# EAGLE design RF (EAGLE 9.6.1)
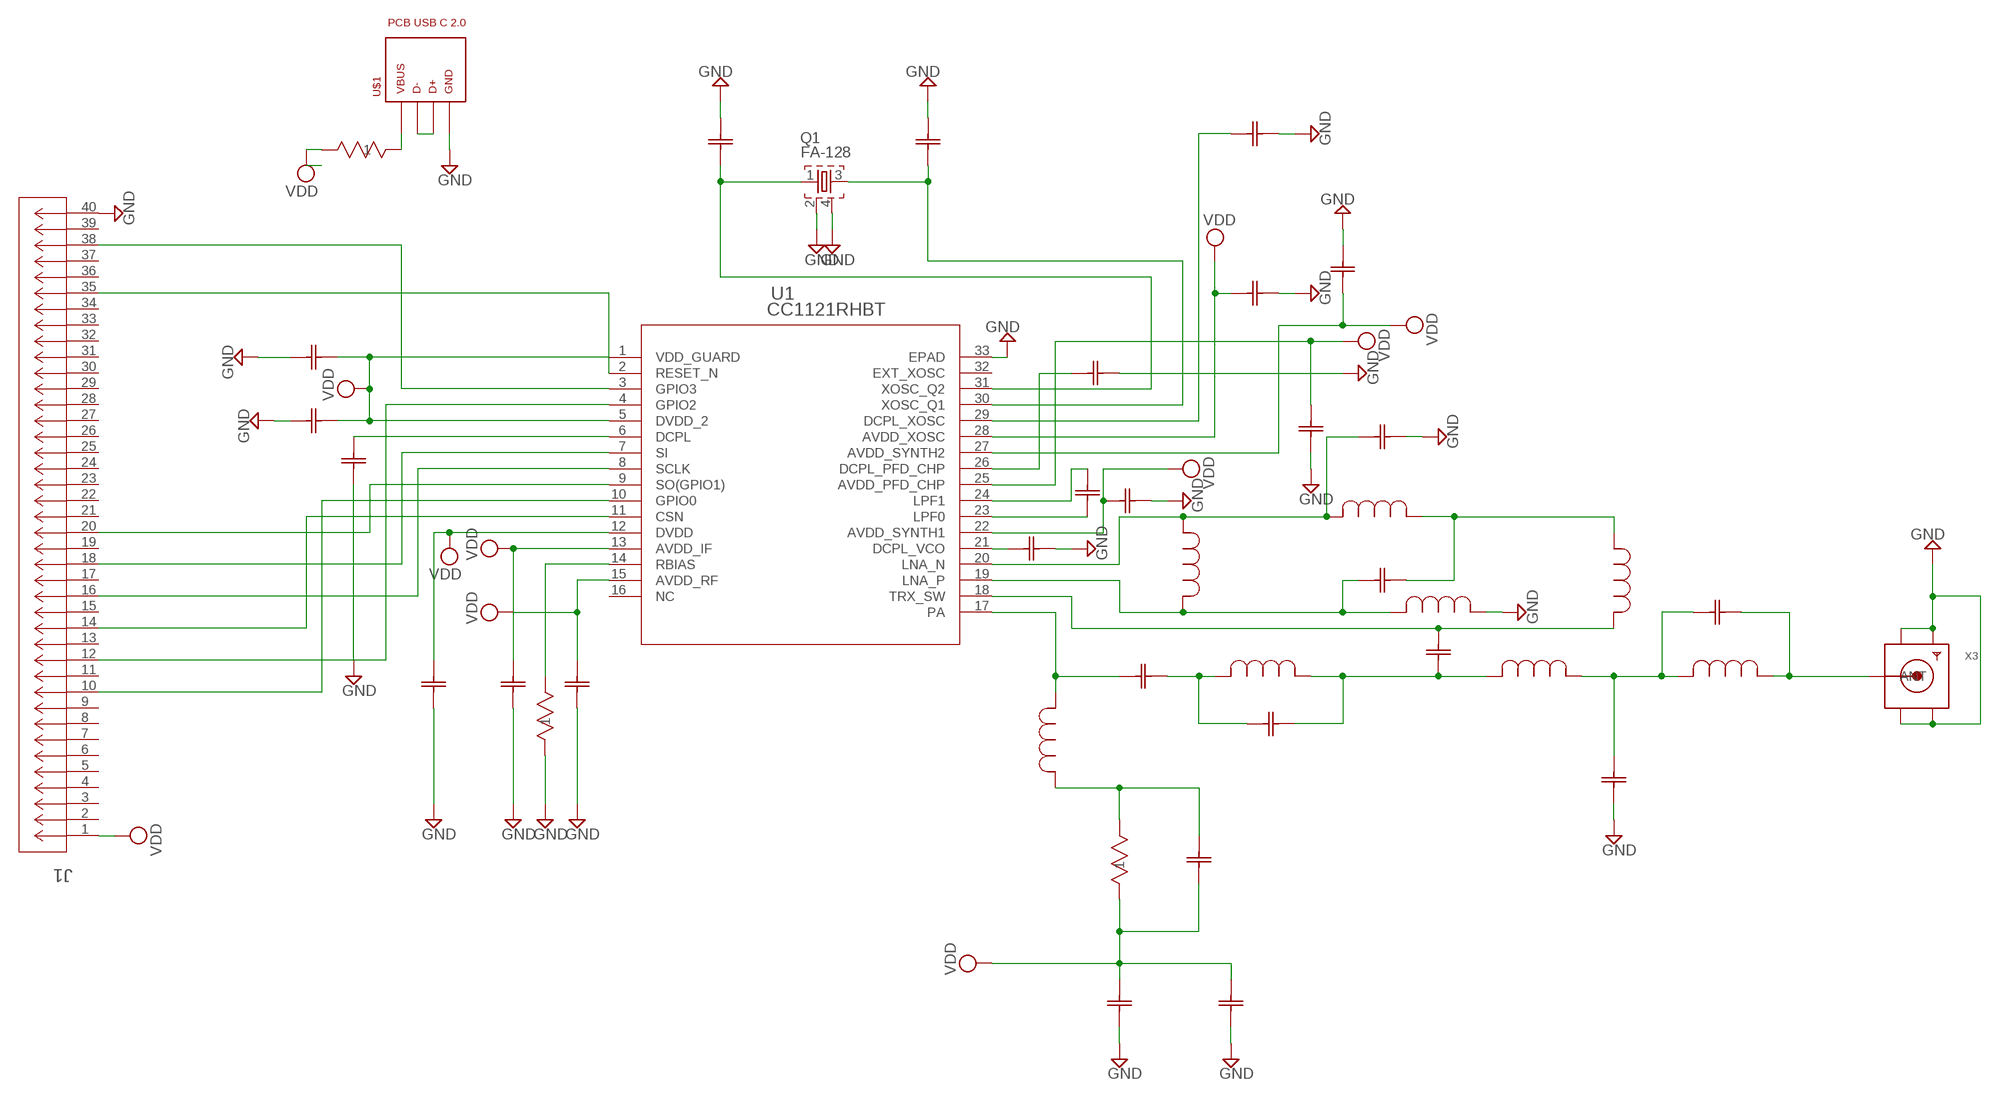
[diagram p0: schematic, sheet 1]

## Parts
C1  220nF  GRM155R71A104KA01D  [G-155_MUR]
C2  47nF  GRM155R71A104KA01D  [G-155_MUR]
C3  15pF  GRM155R71A104KA01D  [G-155_MUR]
C4  1pF  GRM155R71A104KA01D  [G-155_MUR]
C5  2.2pF  GRM155R71A104KA01D  [G-155_MUR]
C6  47nF  GRM155R71A104KA01D  [G-155_MUR]
C7  47nF  GRM155R71A104KA01D  [G-155_MUR]
C8  47nF  GRM155R71A104KA01D  [G-155_MUR]
C9  220nF  GRM155R71A104KA01D  [G-155_MUR]
C10  33pF  GRM155R71A104KA01D  [G-155_MUR]
C11  10pF  GRM155R71A104KA01D  [G-155_MUR]
C12  10pF  GRM155R71A104KA01D  [G-155_MUR]
C13  3pF  GRM155R71A104KA01D  [G-155_MUR]
C14  GRM155R71A104KA01D  [G-155_MUR]
C15  3.3pF  GRM155R71A104KA01D  [G-155_MUR]
C16  3.3pF  GRM155R71A104KA01D  [G-155_MUR]
C17  10nF  GRM155R71A104KA01D  [G-155_MUR]
C18  10nF  GRM155R71A104KA01D  [G-155_MUR]
C19  1.8nF  GRM155R71A104KA01D  [G-155_MUR]
C20  47nF  GRM155R71A104KA01D  [G-155_MUR]
C21  47nF  GRM155R71A104KA01D  [G-155_MUR]
C22  47nF  GRM155R71A104KA01D  [G-155_MUR]
C23  47nF  GRM155R71A104KA01D  [G-155_MUR]
C24  15pF  GRM155R71A104KA01D  [G-155_MUR]
C25  15pF  GRM155R71A104KA01D  [G-155_MUR]
C26  47nF  GRM155R71A104KA01D  [G-155_MUR]
J1  CLT-110-02-L-D-BE  [CON20_2X10_DUME_CLT_SAI]
L1  10nH  LQW15AN13NG00D  [IND_LQW15AN13NG00D_MUR]
L2  10nH  LQW15AN13NG00D  [IND_LQW15AN13NG00D_MUR]
L3  10nH  LQW15AN13NG00D  [IND_LQW15AN13NG00D_MUR]
L4  12nH  LQW15AN13NG00D  [IND_LQW15AN13NG00D_MUR]
L5  15nH  LQW15AN13NG00D  [IND_LQW15AN13NG00D_MUR]
L6  12nH  LQW15AN13NG00D  [IND_LQW15AN13NG00D_MUR]
L7  12nH  LQW15AN13NG00D  [IND_LQW15AN13NG00D_MUR]
L8  12nH  LQW15AN13NG00D  [IND_LQW15AN13NG00D_MUR]
Q1  FA-128  [FA-128]
R1  56k  RK73H1ETTP1003F  [RES_1E0402_1XP5_KOA]
R2  56k  RK73H1ETTP1003F  [RES_1E0402_1XP5_KOA]
R3  56k  RK73H1ETTP1003F  [RES_1E0402_1XP5_KOA]
U1  CC1121RHBT  [RHB32_3P45X3P45_TEX]
U$1  PCB_USB_C_2.0DS_1  [USB_TYPE_C_DS_1]
X3  SMACONNECTOR_EDGE  [SMA_EDGELAUNCH]

## Nets
GND: C1.1 C2.1 C6.1 C7.1 C8.1 C9.1 C11.1 C12.1 C13.1 C16.2 C17.2 C18.2 C20.1 C21.2 C22.2 C23.2 C24.2 C25.2 C26.2 J1.40 L8.1 Q1.2 Q1.4 R1.1 U1.33(EPAD) U$1.A1(GND) U$1.A12(GND) U$1.B1(GND) U$1.B12(GND) X3.GND@1(GND4) X3.GND@2(GND3) X3.GND@3(GND2) X3.GND@4(GND1)
N$1: J1.35 U1.2(RESET_N)
N$2: J1.38 U1.3(GPIO3)
N$3: J1.12 U1.4(GPIO2)
N$4: C9.2 U1.6(DCPL)
N$5: J1.18 U1.7(SI)
N$6: J1.16 U1.8(SCLK)
N$7: J1.20 U1.9(SO(GPIO1))
N$8: J1.10 U1.10(GPIO0)
N$9: J1.14 U1.11(CSN)
N$10: R1.2 U1.14(RBIAS)
N$11: C3.1 L1.1 U1.17(PA)
N$12: C3.2 C4.1 L2.2
N$13: C5.2 L7.1 U1.18(TRX_SW)
N$14: C4.2 C5.1 L2.1 L3.2
N$15: C10.2 L1.2 R2.2
N$16: C15.2 L6.1 L7.2
N$17: C13.2 C14.1 L3.1 L4.2
N$18: C17.1 U1.21(DCPL_VCO)
N$19: C14.2 L4.1 X3.P(ANT)
N$20: C15.1 L5.1 L8.2 U1.19(LNA_P)
N$21: C16.1 L5.2 L6.2 U1.20(LNA_N)
N$22: C19.1 U1.23(LPF0)
N$23: C19.2 U1.24(LPF1)
N$24: C26.1 U1.29(DCPL_XOSC)
N$25: C21.1 U1.26(DCPL_PFD_CHP)
N$26: C25.1 Q1.3 U1.30(XOSC_Q1)
N$27: C24.1 Q1.1 U1.31(XOSC_Q2)
N$28: R3.1 U$1.A4(VBUS) U$1.A9(VBUS) U$1.B4(VBUS) U$1.B9(VBUS)
N$29: U$1.A6(D+) U$1.A7(D-) U$1.B6(D+) U$1.B7(D-)
VDD: C1.2 C2.2 C6.2 C7.2 C8.2 C10.1 C11.2 C12.2 C18.1 C20.2 C22.1 C23.1 J1.1 R2.1 R3.2 U1.1(VDD_GUARD) U1.5(DVDD_2) U1.12(DVDD) U1.13(AVDD_IF) U1.15(AVDD_RF) U1.22(AVDD_SYNTH1) U1.25(AVDD_PFD_CHP) U1.27(AVDD_SYNTH2) U1.28(AVDD_XOSC)
Unconnected: J1.2 J1.3 J1.4 J1.5 J1.6 J1.7 J1.8 J1.9 J1.11 J1.13 J1.15 J1.17 J1.19 J1.21 J1.22 J1.23 J1.24 J1.25 J1.26 J1.27 J1.28 J1.29 J1.30 J1.31 J1.32 J1.33 J1.34 J1.36 J1.37 J1.39 U1.16(NC) U1.32(EXT_XOSC)

## Library data of the parts
C1-C26 = GRM155R71A104KA01D:GRM155R71A104KA01D; COPYRIGHT: Copyright (C) 2015 Accelerated Designs. All rights reserved; MANUFACTURER_PART_NUMBER: GRM155R71A104KA01D; SOURCELIBRARY: Murata_2014-12-31; VENDOR: Murata
J1 = 2x10_socket:CLT-110-02-L-D-BE; BUILT_BY: EMA_UL_Team; MANUFACTURER_PART_NUMBER: CLT-110-02-L-D-BE; SOURCELIBRARY: Samtec_2008-01-01_CLT; VENDOR: Samtec Inc
L1-L8 = LQW15AN10NJ00D:LQW15AN13NG00D; BUILT_BY: EMA_Cory; COPYRIGHT: Copyright (C) 2018 Accelerated Designs. All rights reserved; DATASHEET: https://search.murata.co.jp/Ceramy/image/img/P02/JELF243A-0050.pdf; MANUFACTURER_PART_NUMBER: LQW15AN13NG00D; SOURCELIBRARY: Murata_2020-09-02; VENDOR: Murata
Q1 = crystal:FA-: MHz RANGE CRYSTAL UNIT Source: Epson Toyocom
R1-R3 = RK37H1ETTP5602F:RK73H1ETTP1003F; BUILT_BY: EMA_Anthony; COPYRIGHT: Copyright (C) 2018 Accelerated Designs. All rights reserved; DATASHEET: http://www.koaspeer.com/pdfs/RK73H.pdf; MANUFACTURER_PART_NUMBER: RK73H1ETTP1003F; SOURCELIBRARY: KOA_Speer_2020-02-20; VENDOR: KOA Speer
U1 = CC1121 RF:CC1121RHBT; BUILT_BY: EMA_UL_Team; MANUFACTURER_PART_NUMBER: CC1121RHBT; SOURCELIBRARY: TI_2016-08-12; VENDOR: Texas Instruments
U$1 = USB_pcb_connectors:PCB_USB_C_2.0
X3 = adafruit:SMACONNECTOR: SMA Connector 90° DIP SMA Connector, 50 Ohm (4UConnector: 07259)

## Board
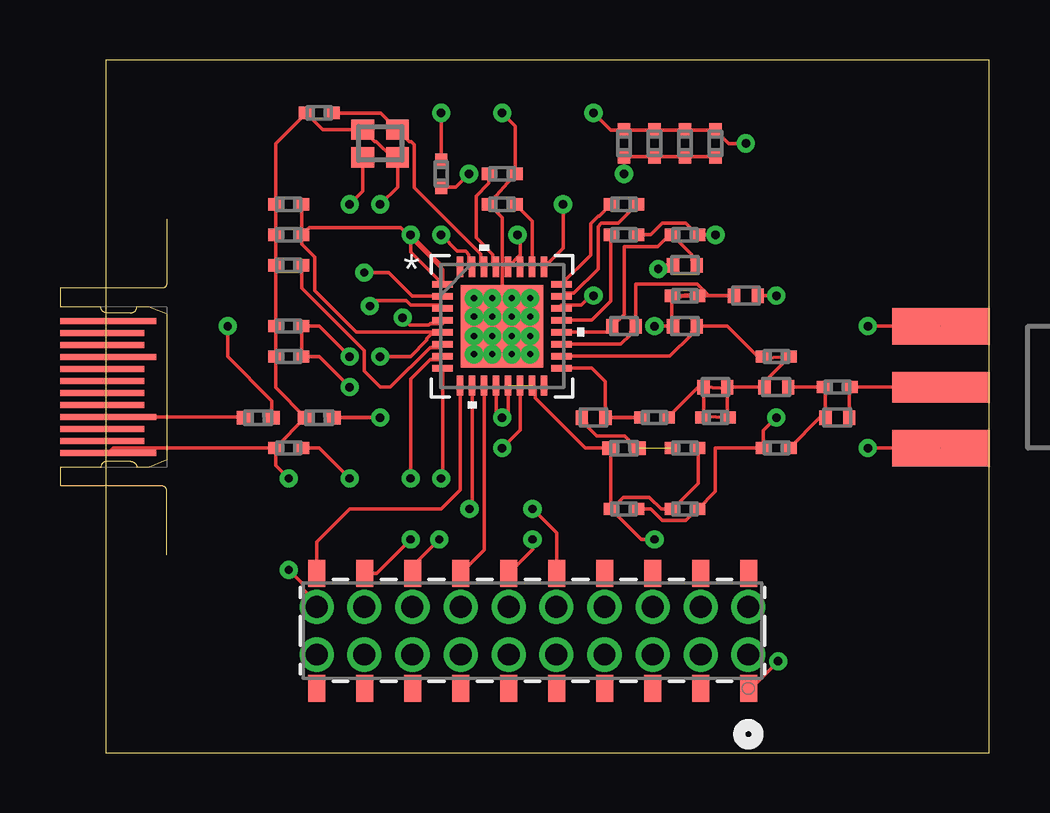
[diagram p1: board, top side]
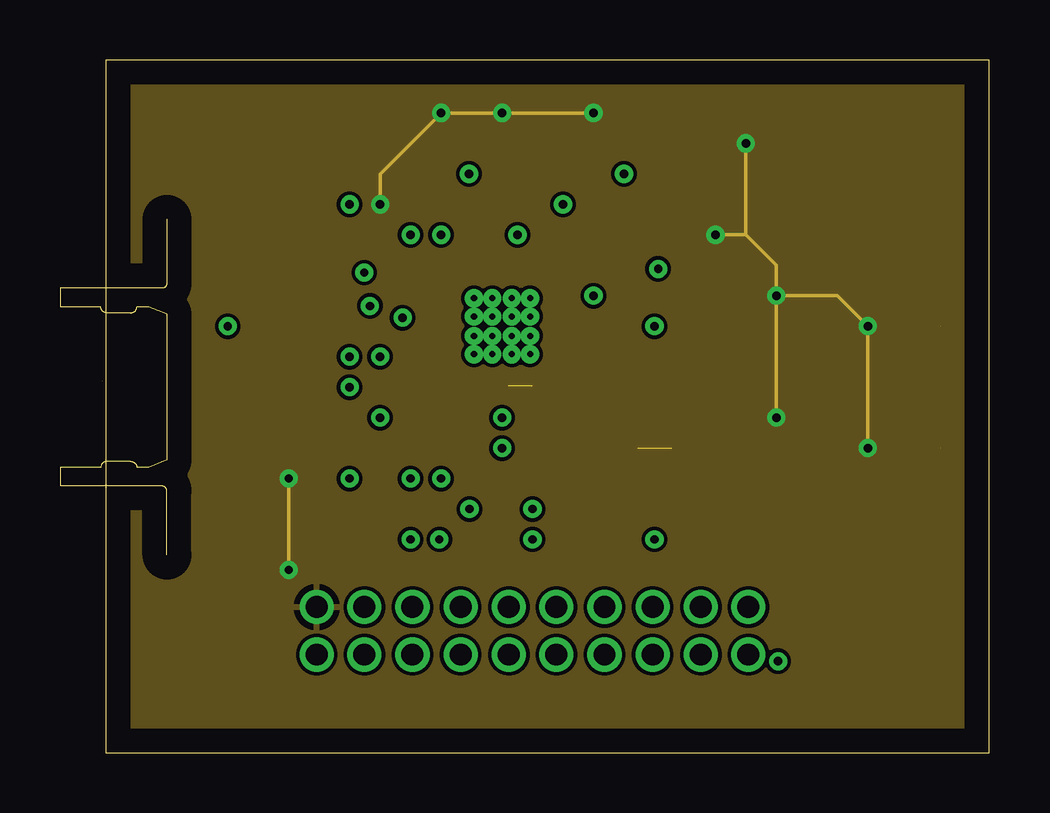
[diagram p2: board, inner layer GND]
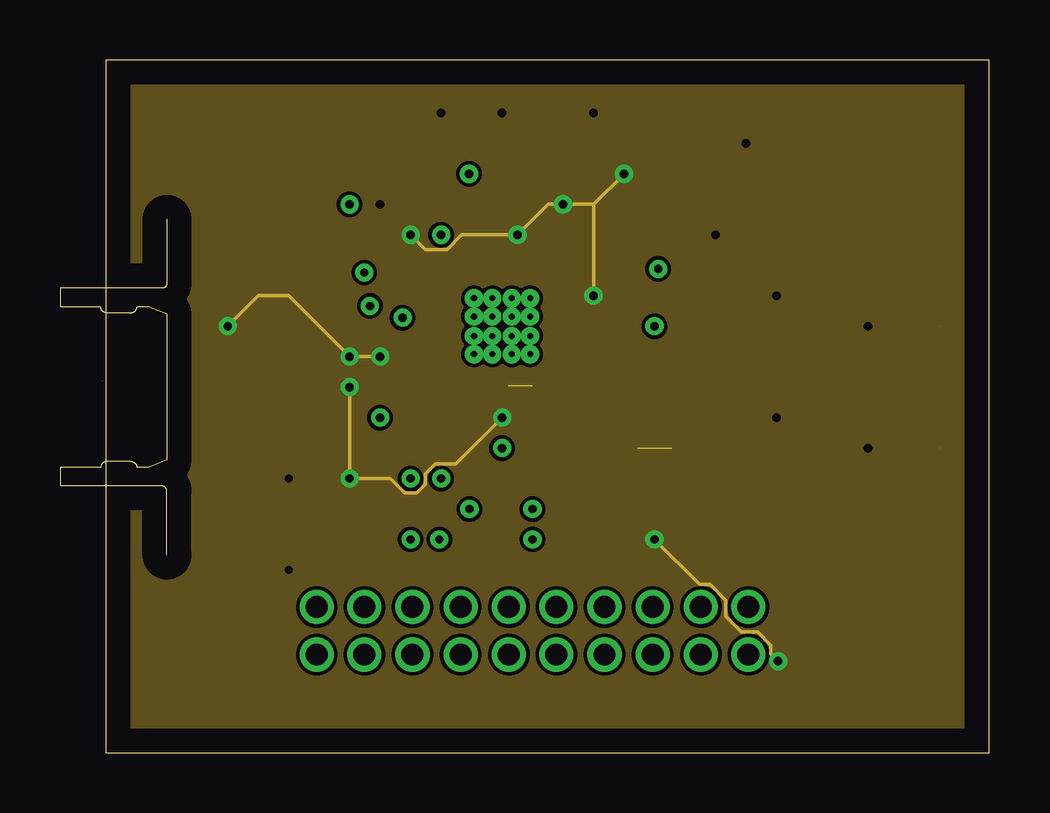
[diagram p3: board, inner layer VDD]
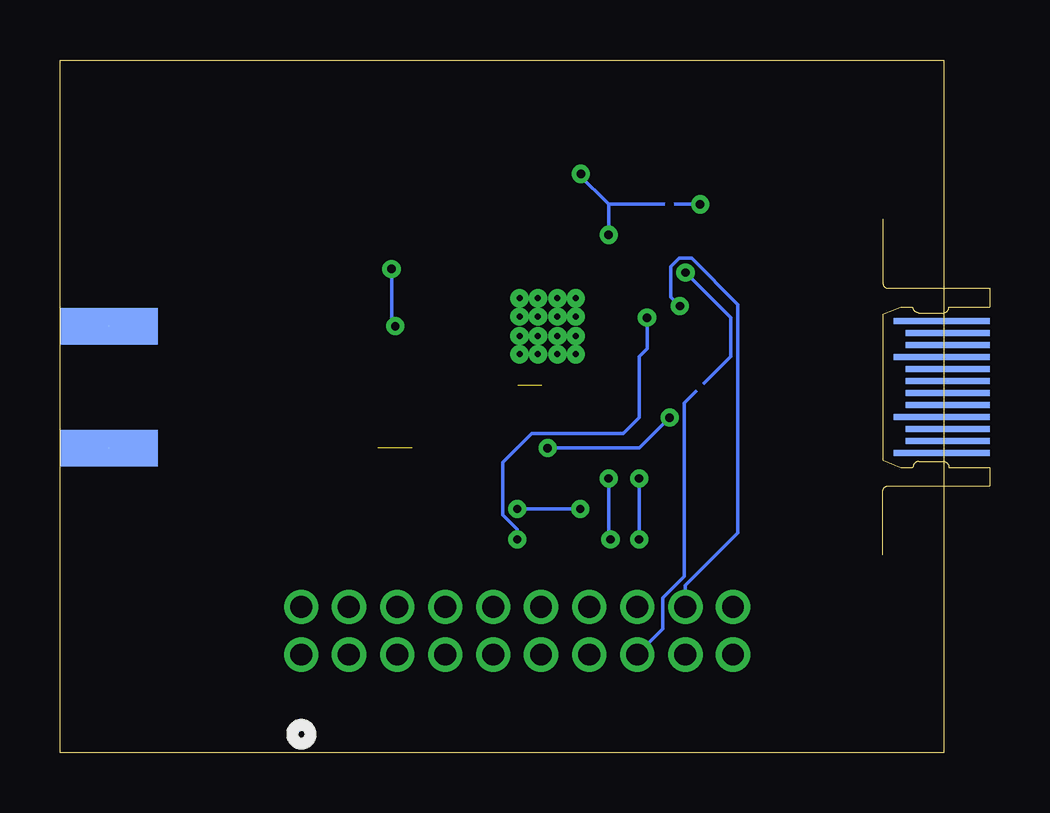
[diagram p4: board, bottom side, seen from below]

Size 36.81 x 28.88 mm. Coordinates in mm from the lower left corner, seen from the top.
Outline: 0,0 36.81,0 36.81,28.88 0,28.88 0,0
Copper layers ([2:[15:1+2*15+16]:15]): Top 0.035559375mm / dielectric 0.17018125mm / GND 0.01778125mm / dielectric 47mil / VDD 0.01778125mm / dielectric 0.17018125mm / Bottom 0.035559375mm
Design rules "default *": minimum track width 6mil, minimum drill 0.35mm, track to track 6mil, track to pad 6mil, pad to pad 6mil, via to via 6mil, smd to smd 6mil, copper to edge 40mil, drill to drill 6mil, minimum pad ring 10mil, minimum via ring 8mil, stop-mask expansion 4mil, vias tented up to drill 0mil, thermal gap 10mil

### Footprints (pad centres in the part's own frame; a part is rotated, then mirrored left to right if it is on the bottom)
G-155_MUR = smd 0.61 x 0.508: 1 -0.546,0; 2 0.546,0
CON20_2X10_DUME_CLT_SAI = smd 0.711 x 1.118: 1 9,-2.4; 2 9,2.4; 3 7,-2.4; 4 7,2.4; 5 5,-2.4; 6 5,2.4; 7 3,-2.4; 8 3,2.4; 9 1,-2.4; 10 1,2.4; 11 -1,-2.4; 12 -1,2.4; 13 -3,-2.4; 14 -3,2.4; 15 -5,-2.4; 16 -5,2.4; 17 -7,-2.4; 18 -7,2.4; 19 -9,-2.4; 20 -9,2.4 | drill 0.914 pad 0.914: 21 8.992,-0.991; 22 8.992,0.991; 23 7.01,-0.991; 24 7.01,0.991; 25 5.004,-0.991; 26 5.004,0.991; 27 2.997,-0.991; 28 2.997,0.991; 29 0.991,-0.991; 30 0.991,0.991; 31 -0.991,-0.991; 32 -0.991,0.991; 33 -2.997,-0.991; 34 -2.997,0.991; 35 -5.004,-0.991; 36 -5.004,0.991; 37 -7.01,-0.991; 38 -7.01,0.991; 39 -8.992,-0.991; 40 -8.992,0.991
IND_LQW15AN13NG00D_MUR = smd 0.508 x 0.61: 1 -0.495,0; 2 0.495,0
FA-128 = smd 0.95 x 0.85: 1 -0.725,-0.575; 2 0.725,-0.575; 3 0.725,0.575; 4 -0.725,0.575
RES_1E0402_1XP5_KOA = smd 0.66 x 0.559: 1 -0.572,0; 2 0.572,0
RHB32_3P45X3P45_TEX = smd 0.85 x 0.28: 1 -2.475,1.75; 2 -2.475,1.25; 3 -2.475,0.75; 4 -2.475,0.25; 5 -2.475,-0.25; 6 -2.475,-0.75; 7 -2.475,-1.25; 8 -2.475,-1.75; 17 2.475,-1.75; 18 2.475,-1.25; 19 2.475,-0.75; 20 2.475,-0.25; 21 2.475,0.25; 22 2.475,0.75; 23 2.475,1.25; 24 2.475,1.75 | smd 0.28 x 0.85: 9 -1.75,-2.475; 10 -1.25,-2.475; 11 -0.75,-2.475; 12 -0.25,-2.475; 13 0.25,-2.475; 14 0.75,-2.475; 15 1.25,-2.475; 16 1.75,-2.475; 25 1.75,2.475; 26 1.25,2.475; 27 0.75,2.475; 28 0.25,2.475; 29 -0.25,2.475; 30 -0.75,2.475; 31 -1.25,2.475; 32 -1.75,2.475 | smd 3.45 x 3.45: 33 0,0 | drill 0.254 pad 0.508: V -1.168,-1.168; V_1 -1.168,-0.406; V_2 -1.168,0.406; V_3 -1.168,1.168; V_4 -0.406,-1.168; V_5 -0.406,-0.406; V_6 -0.406,0.406; V_7 -0.406,1.168; V_8 0.406,-1.168; V_9 0.406,-0.406; V_10 0.406,0.406; V_11 0.406,1.168; V_12 1.168,-1.168; V_13 1.168,-0.406; V_14 1.168,0.406; V_15 1.168,1.168
USB_TYPE_C_DS_1 = smd 0.25 x 4: A1 2.75,-2.45; A4 1.25,-2.45; A9 -1.25,-2.45; A12 -2.75,-2.45 | smd 0.25 x 3.5: A2 2.25,-2.7; A3 1.75,-2.7; A5 0.75,-2.7; A6 0.25,-2.7; A7 -0.25,-2.7; A8 -0.75,-2.7; A10 -1.75,-2.7; A11 -2.25,-2.7 | smd 0.25 x 4 bottom: B1 -2.75,-2.45; B4 -1.25,-2.45; B9 1.25,-2.45; B12 2.75,-2.45 | smd 0.25 x 3.5 bottom: B2 -2.25,-2.7; B3 -1.75,-2.7; B5 -0.75,-2.7; B6 -0.25,-2.7; B7 0.25,-2.7; B8 0.75,-2.7; B10 1.75,-2.7; B11 2.25,-2.7
SMA_EDGELAUNCH = smd 4.064 x 1.524: GND@1 2.032,-2.54; GND@2 2.032,2.54 | smd 4.064 x 1.524 bottom: GND@3 2.032,2.54; GND@4 2.032,-2.54 | smd 4.064 x 1.27: P 2.032,0

### Placement (x,y rotation side)
C1  7.62,21.59 0 top
C2  7.62,12.7 0 top
C3  22.86,13.97 0 top
C4  25.4,13.97 0 top
C5  27.94,16.51 180 top
C6  7.62,22.86 0 top
C7  7.62,17.78 0 top
C8  7.62,16.51 0 top
C9  7.62,20.32 0 top
C10  24.13,12.7 180 top
C11  21.59,10.16 180 top
C12  24.13,10.16 180 top
C13  27.94,12.7 0 top
C14  30.48,15.24 0 top
C15  24.13,19.05 180 top
C16  24.13,21.59 0 top
C17  21.59,21.59 0 top
C18  24.13,25.4 90 top
C19  21.59,22.86 180 top
C20  25.4,25.4 270 top
C21  16.51,22.86 180 top
C22  21.59,25.4 90 top
C23  22.86,25.4 90 top
C24  13.97,24.13 90 top
C25  8.89,26.67 180 top
C26  16.51,24.13 0 top
J1  17.78,5.08 0 top
L1  20.32,13.97 180 top
L2  25.4,15.24 180 top
L3  27.94,15.24 180 top
L4  30.48,13.97 180 top
L5  21.59,17.78 180 top
L6  24.13,20.32 0 top
L7  24.13,17.78 180 top
L8  26.67,19.05 180 top
Q1  11.43,25.4 0 top
R1  8.89,13.97 0 top
R2  21.59,12.7 0 top
R3  6.35,13.97 0 top
U1  16.51,17.78 0 top
U$1  2.54,15.24 270 top
X3  36.83,15.24 180 top

### Tracks (layer width: path | path; a pad name or v marks a point on that pad's centre or on a via)
GND  (via drill 0.35 layers 1-2)  (2 unrouted)
  Top 0.152: v27.94,13.97 27.39,13.42 C13.1 25.4,12.7 25.4,10.88 C12.1 24.65,10.16 24.17,9.68 23.18,9.68 22.7,10.16 C11.1 | v31.75,17.78 X3.GND@4 | L8.1 v27.94,19.05 | C16.2 v25.4,21.59 24.65,21.59 24.17,22.07 23.18,22.07 22.7,21.59 C17.2 | v31.75,12.7 X3.GND@3 | v26.67,25.4 25.95,25.4 C20.1 C18.2 C23.2 C22.2 21.04,25.95 v20.32,26.67 | v16.51,26.67 17.06,26.12 C26.2 C21.2 16.51,22.31 U1.33 | v13.97,26.67 C24.2 | v11.43,22.86 12.16,23.59 Q1.2 11.93,24.82 11.27,25.48 11.2,25.48 Q1.4 9.04,25.97 C25.2 7.07,25.4 C6.1 C1.1 C9.1 C7.1 C8.1 7.07,15.21 R1.1 7.07,12.72 C2.1 | U$1.B12 0.3,12.7 C2.1 | U1.33 17.78,16.51 | U1.33 15.24,17.78 | C2.1 7.07,11.98 v7.62,11.43 | v7.62,7.62 8.2,7.04 8.2,6.83 8.79,6.23 J1.40
  GND 0.152: v27.94,13.97 v27.94,19.05 | v27.94,19.05 30.48,19.05 v31.75,17.78 v31.75,12.7 | v25.4,21.59 26.67,21.59 | 26.67,21.59 27.94,20.32 v27.94,19.05 | v26.67,25.4 26.67,21.59 | v20.32,26.67 v16.51,26.67 v13.97,26.67 11.43,24.13 v11.43,22.86 | v7.62,11.43 v7.62,7.62
  pour GND: -1.27,30.48 -1.27,-1.27 38.1,-1.27 38.1,30.48
N$1  (via drill 0.35)
  Top 0.152: U1.2 12.77,19.03 11.78,20.02 v10.77,20.02
  Bottom 0.152: v10.77,20.02 8.89,18.14 8.89,16.51 10.82,14.58 10.82,7.35 11.71,6.46 11.71,5.16 J1.35
N$2  (via drill 0.35)
  Top 0.152: U1.3 13.9,18.66 12.7,18.66 12.51,18.86 11.24,18.86 v11,18.62
  Bottom 0.152: J1.38 10.77,6.97 8.59,9.15 8.59,18.69 10.52,20.62 11.02,20.62 11.37,20.27 11.37,18.99 v11,18.62
N$3  (via drill 0.35)
  Top 0.152: U1.4 14.04,17.9 13.52,17.9 13.45,17.84 12.67,17.84 v12.37,18.14 | 16.51,7.75 J1.12 17.78,8.48 v17.78,8.89
  Bottom 0.152: v12.37,18.14 12.37,16.84 12.7,16.51 12.7,13.97 13.36,13.31 17.17,13.31 18.39,12.09 18.39,9.91 17.78,9.3 v17.78,8.89
N$4
  Top 0.152: U1.6 13.9,16.9 13.52,16.9 11.86,15.24 11.43,15.24 10.77,15.9 10.77,16.76 8.17,19.36 C9.2
N$5  (via drill 0.35)
  Top 0.152: U1.7 13.9,16.4 13.52,16.4 12.7,15.58 v12.7,11.43 | v12.7,8.89 11.29,7.48 J1.18
  Bottom 0.152: v12.7,11.43 v12.7,8.89
N$6  (via drill 0.35)
  Top 0.152: U1.8 14.04,11.5 v13.97,11.43 | v13.89,8.89 12.78,7.78 J1.16
  Bottom 0.152: v13.97,11.43 13.97,8.89 v13.89,8.89
N$7
  Top 0.152: U1.9 14.76,10.95 13.97,10.16 10.16,10.16 8.78,8.78 J1.20
N$8  (via drill 0.35)
  Top 0.152: U1.10 15.26,10.18 15.24,10.16 v15.15,10.16 | v17.78,10.16 18.78,9.16 J1.10
  Bottom 0.152: v15.15,10.16 v17.78,10.16
N$9
  Top 0.152: U1.11 15.76,8.46 J1.14
N$10  (via drill 0.35)
  Top 0.152: U1.14 17.26,13.45 v16.51,12.7 | v11.43,13.97 R1.2
  Bottom 0.152: v16.51,12.7 12.7,12.7 v11.43,13.97
N$11
  Top 0.152: U1.17 20.26,16.03 20.81,15.47 L1.1 C3.1
N$12
  Top 0.152: 25.95,15.19 L2.2 | L2.2 24.68,15.24 C3.2 | C4.1 24.91,14.02 L2.2
N$13
  Top 0.152: U1.18 23.5,16.53 24.41,17.44 24.41,17.56 L7.1 25.9,17.78 27.16,16.51 C5.2
N$14
  Top 0.152: 24.91,14.02 C4.2 25.9,14.02 L2.1 L3.2 27.45,15.47 C5.1 27.45,16.46
N$15  (1 unrouted)
  Top 0.152: L1.2 20.04,13.75 20.04,13.63 20.46,13.21 21.63,13.21 22.13,12.7 R2.2
N$16  (via drill 0.35)
  Top 0.152: 24.62,19.1 C15.2 23.58,17.83 L7.2 v22.86,17.78 | L6.1 22.86,20.32 v23.02,20.16
  Bottom 0.152: v23.02,20.16 23.02,17.94 v22.86,17.78
N$17
  Top 0.152: L3.1 C14.1 29.99,15.19 L4.2 29.76,13.97 C13.2
N$18
  Top 0.152: C17.1 21.04,18.82 20.26,18.03 U1.21
N$19
  Top 0.152: X3.P C14.2 30.98,15.19 L4.1
N$20
  Top 0.152: 23.63,19 C15.1 25.12,19.05 | 25.12,19.05 L8.2 | 25.12,19.05 24.63,19.53 22.09,19.53 L5.1 21.87,17.56 21.87,17.44 21.46,17.03 U1.19
N$21
  Top 0.152: U1.20 20.84,17.53 L5.2 21.59,18.28 21.59,21.11 23.01,21.11 23.49,21.59 C16.1 24.41,20.77 24.41,20.54 L6.2
N$22
  Top 0.152: U1.23 19.12,19.16 19.51,19.16 20.51,20.17 20.51,21.94 20.64,22.07 21.35,22.07 C19.1
N$23
  Top 0.152: U1.24 20.21,20.75 20.21,22.07 20.52,22.38 20.56,22.38 C19.2
N$24
  Top 0.152: U1.29 16.13,20.39 16.13,20.78 15.43,21.47 15.43,23.21 15.96,23.74 C26.1
N$25
  Top 0.152: U1.26 17.76,22.16 C21.1
N$26
  Top 0.152: U1.30 15.63,20.39 15.63,20.79 12.86,23.56 12.86,25.35 12.73,25.48 12.65,25.48 Q1.3 11.46,26.67 C25.1
N$27  (via drill 0.35)
  Top 0.152: U1.31 15.13,20.39 15.13,20.78 14.99,20.91 14.65,20.91 v13.97,21.59 | v15.13,24.13 14.58,23.58 C24.1 | Q1.1 10.7,23.4 v10.16,22.86
  Bottom 0.152: v13.97,21.59 13.97,22.86 | 13.97,22.86 15.24,24.13 v15.13,24.13 | 13.97,22.86 v10.16,22.86
N$28
  Top 0.152: U$1.B9 5.76,13.99 R3.1
N$29  (1 unrouted)
VDD  (via drill 0.35 layers 1-15)  (1 unrouted)
  Top 0.152: C20.2 C18.1 C23.1 C22.1 v21.59,24.13 | v19.05,22.86 19.05,21.04 U1.25 | C1.2 C6.2 | v10.16,16.51 8.89,17.78 C7.2 C8.2 8.89,16.51 v10.16,15.24 | R3.2 6.92,14.67 5.08,16.51 v5.08,17.78 | U1.22 18.98,18.66 19.81,18.66 20.2,19.05 v20.32,19.05 | v10.16,11.43 8.89,12.7 C2.2 | U1.12 16.26,14.22 v16.51,13.97 16.76,14.22 U1.13 | C10.1 24.68,11.23 23.85,10.4 23.85,10.16 C12.2 23.13,10.16 22.65,10.64 21.55,10.64 21.07,10.16 C11.2 | C11.2 21.04,12.68 R2.1 19.98,12.7 17.89,14.79 17.89,15.17 U1.15 | v11.43,16.51 12.7,16.51 13.38,17.2 13.38,17.27 13.65,17.53 U1.5 10.43,17.53 8.7,19.26 8.7,20.67 8.17,21.2 C1.2 | U1.27 17.26,20.32 | 17.26,20.32 17.26,20.75 | v17.15,21.59 17.26,21.59 17.26,20.75 | 17.26,20.32 16.83,20.32 U1.28 17.26,20.75 | U1.1 13.97,19.53 13.97,20.32 v12.7,21.59 12.7,20.86 U1.1 | U1.1 14.04,20.14 12.29,21.89 8.47,21.89 C1.2 | C11.2 22.31,8.89 v22.86,8.89 | v28.01,3.81 26.88,2.68 J1.1
  VDD 0.152: v21.59,24.13 20.32,22.86 | v5.08,17.78 6.35,19.05 7.62,19.05 v10.16,16.51 v11.43,16.51 | v20.32,19.05 20.32,22.86 | 20.32,22.86 v19.05,22.86 18.42,22.86 v17.15,21.59 14.83,21.59 14.22,20.98 13.31,20.98 v12.7,21.59 | v10.16,15.24 v10.16,11.43 11.84,11.43 12.45,10.82 12.95,10.82 13.31,11.18 13.31,11.63 13.72,12.04 14.58,12.04 v16.51,13.97 | v22.86,8.89 24.74,7.01 25.18,7.01 25.83,6.36 25.83,5.68 26.48,5.03 27.16,5.03 27.71,4.48 27.71,4.11 v28.01,3.81
  pour VDD: -2.54,31.75 -2.54,-2.54 39.37,-2.54 39.37,31.75